# Altium project Simrig_controller.PrjPcb
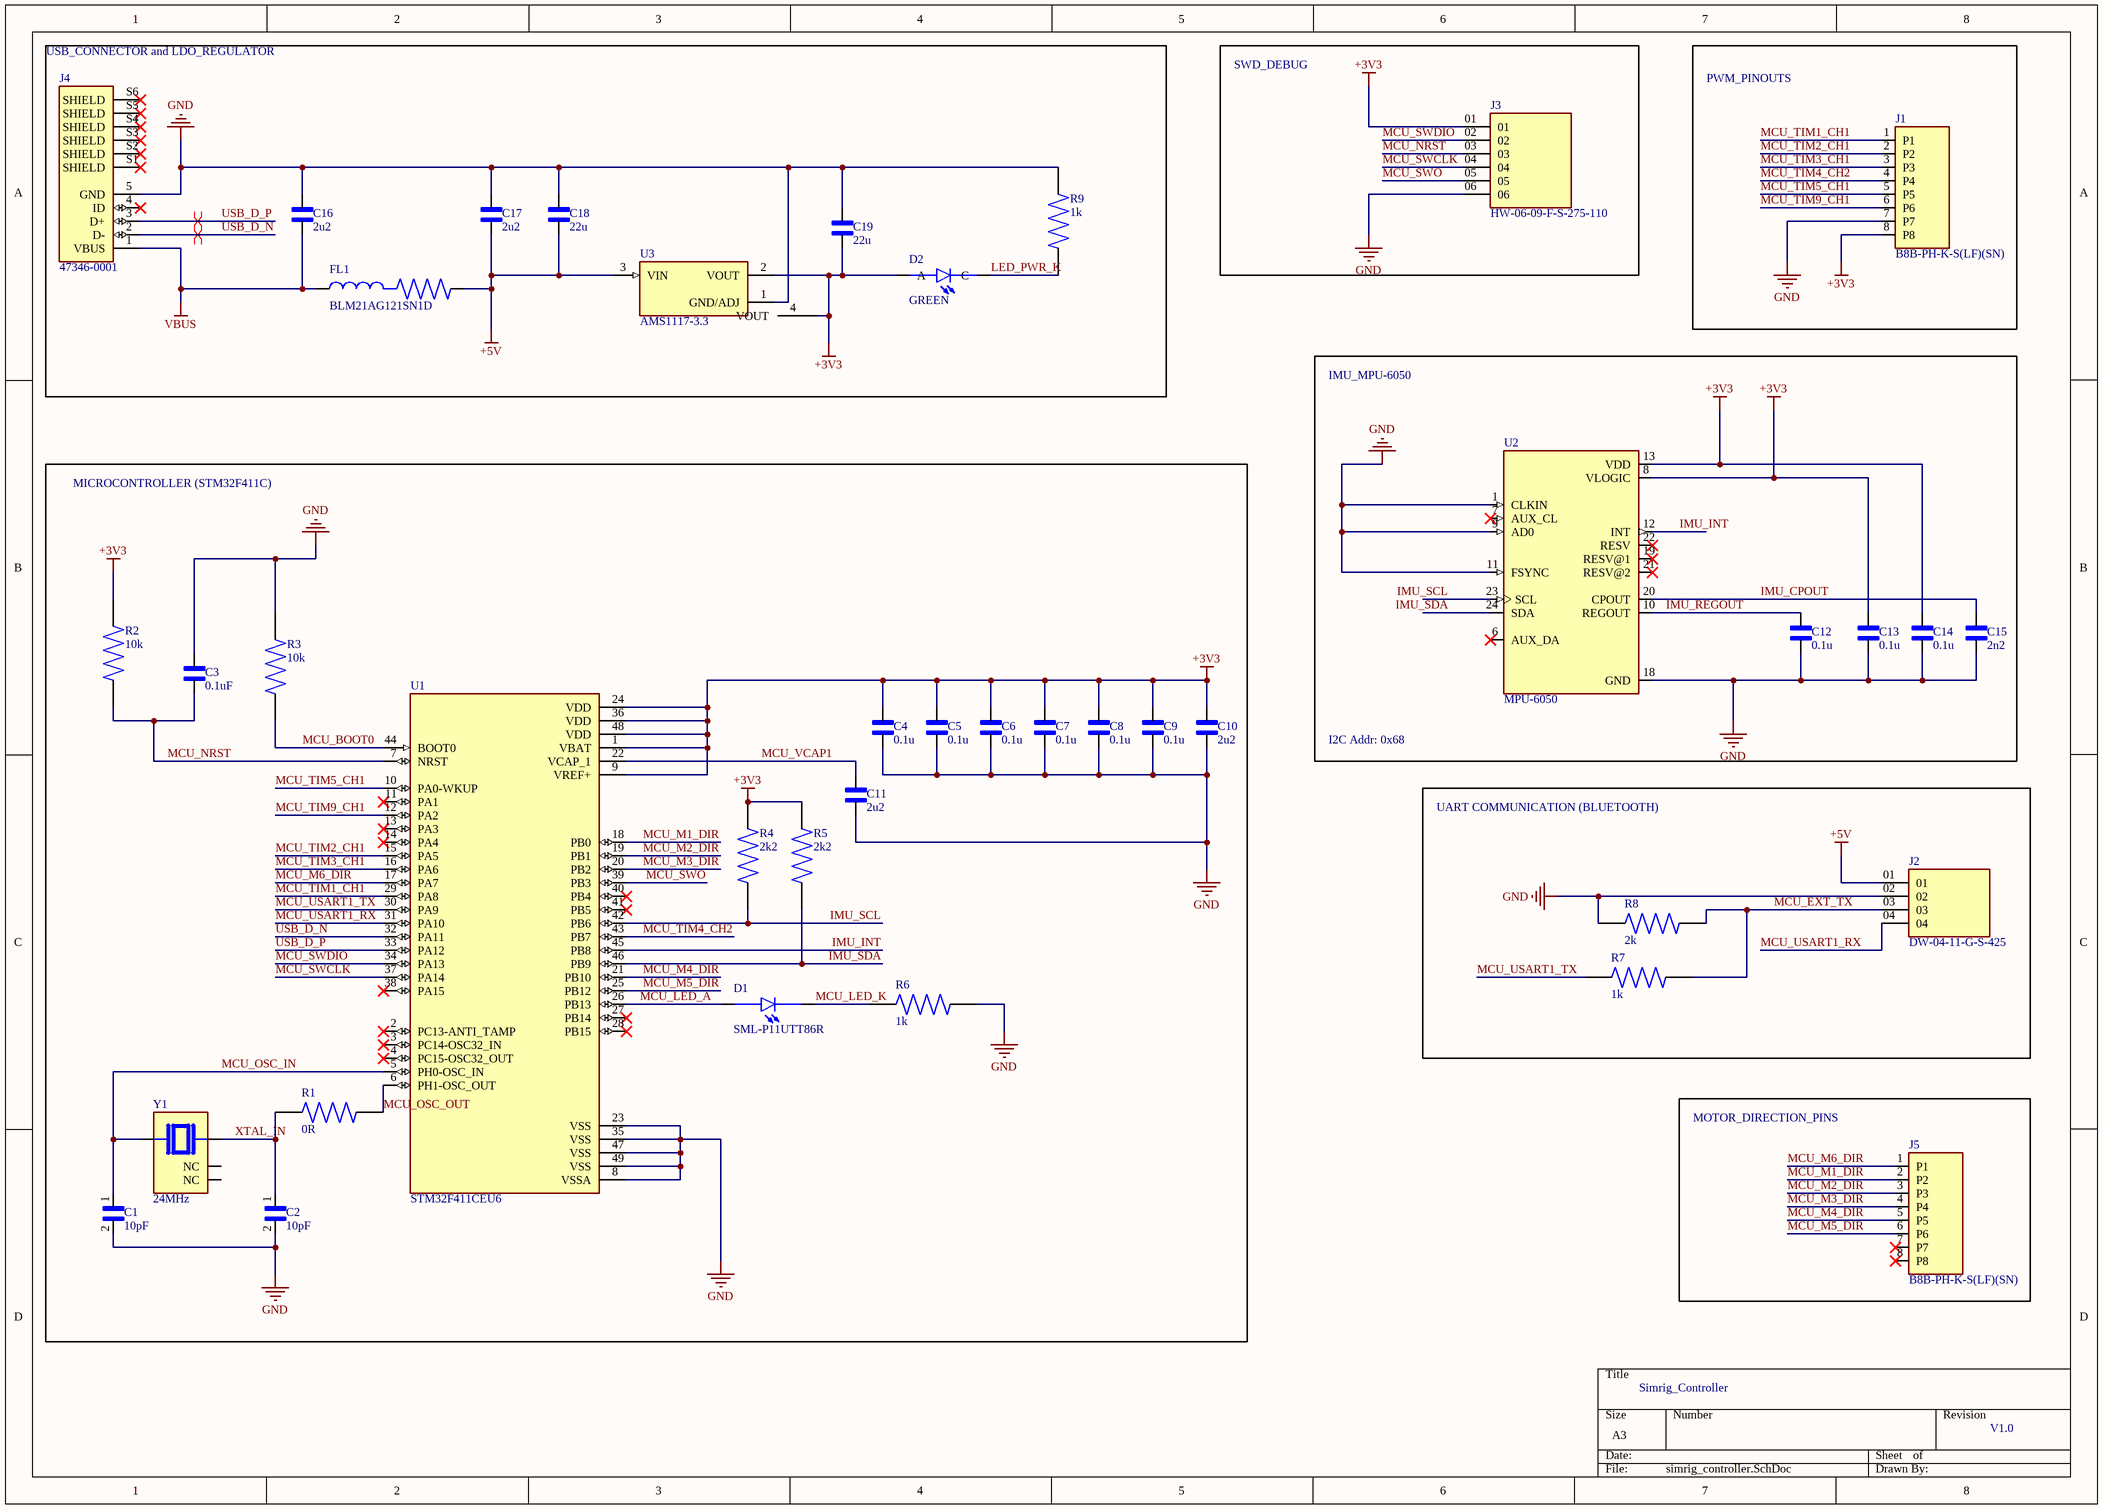
[diagram p0: simrig_controller.SchDoc]
1 sheet, 40 parts. Net scope: global (net labels, ports and power ports of the same name join across sheets).
Board file: simrig_controller.PcbDoc

## Sheet simrig_controller.SchDoc
size A3

### Parts
C1  10pF  [CAPC1005X55N]
C2  10pF  [CAPC1005X55N]
C3  0.1uF  [CAPC1005X55N]
C4  0.1u  [CAPC1005X55N]
C5  0.1u  [CAPC1005X55N]
C6  0.1u  [CAPC1005X55N]
C7  0.1u  [CAPC1005X55N]
C8  0.1u  [CAPC1005X55N]
C9  0.1u  [CAPC1005X55N]
C10  2u2  [CAPC1608X90N]
C11  2u2  [CAPC1608X90N]
C12  0.1u  [CAPC1005X55N]
C13  0.1u  [CAPC1005X55N]
C14  0.1u  [CAPC1005X55N]
C15  2n2  [CAPC1005X55N]
C16  2u2  [CAPC1608X90N]
C17  2u2  [CAPC1608X90N]
C18  22u  [CAPC2012X145N]
C19  22u  [CAPC2012X145N]
D1  SML-P11UTT86R  [LED_SML-P11UTT86R]
D2  GREEN  [LED_SML-P11UTT86R]
FL1  BLM21AG121SN1D  [BEADC2012X105N]
J1  B8B-PH-K-S(LF)(SN)  [JST_B8B-PH-K-S(LF)(SN)]
J2  DW-04-11-G-S-425  [SAMTEC_DW-04-11-G-S-425]
J3  HW-06-09-F-S-275-110  [SAMTEC_HW-06-09-F-S-275-110]
J4  47346-0001  [MOLEX_47346-0001]
J5  B8B-PH-K-S(LF)(SN)  [JST_B8B-PH-K-S(LF)(SN)]
R1  0R  [RESC1005X37N]
R2  10k  [RESC1005X37N]
R3  10k  [RESC1005X37N]
R4  2k2  [RESC1005X35N]
R5  2k2  [RESC1005X35N]
R6  1k  [RESC1005X37N]
R7  1k  [RESC1005X37N]
R8  2k  [RESC1005X37N]
R9  1k  [RESC1005X37N]
U1  STM32F411CEU6  [QFN50P700X700X60-49N]
U2  MPU-6050  [QFN50P400X400X95-24N]
U3  AMS1117-3.3  [SOT229P700X180-4N]
Y1  24MHz  [XTAL_7V24000002]

### Blocks framed on the sheet
USB_CONNECTOR and LDO_REGULATOR: C16-C19 D2 FL1 J4 R9 U3
SWD_DEBUG: J3
PWM_PINOUTS: J1
MICROCONTROLLER (STM32F411C): C1-C11 D1 R1-R6 U1 Y1
UART COMMUNICATION (BLUETOOTH): J2 R7 R8
MOTOR_DIRECTION_PINS: J5

### Nets
+3V3: C4.1 C5.1 C6.1 C7.1 C8.1 C9.1 C10.2 C13.1 C14.1 C19.1 D2.A J1.8(P8) J3.01 R2.1 R4.2 R5.2 U1.1(VBAT) U1.9(VREF+) U1.24(VDD) U1.36(VDD) U1.48(VDD) U2.8(VLOGIC) U2.13(VDD) U3.2(VOUT) U3.4(VOUT)
+5V: C17.1 C18.1 FL1.2 J2.01 U3.3(VIN)
GND: C1.2 C2.2 C3.1 C4.2 C5.2 C6.2 C7.2 C8.2 C9.2 C10.1 C11.1 C12.1 C13.2 C14.2 C15.2 C16.2 C17.2 C18.2 C19.2 J1.7(P7) J2.02 J3.06 J4.5(GND) R3.2 R6.1 R8.2 R9.2 U1.8(VSSA) U1.23(VSS) U1.35(VSS) U1.47(VSS) U1.49(VSS) U2.1(CLKIN) U2.9(AD0) U2.11(FSYNC) U2.18(GND) U3.1(GND/ADJ)
VBUS: C16.1 FL1.1 J4.1(VBUS)
IMU_CPOUT: C15.1 U2.20(CPOUT)
IMU_INT: U1.45(PB8) U2.12(INT)
IMU_REGOUT: C12.2 U2.10(REGOUT)
IMU_SCL: R4.1 U1.42(PB6) U2.23(SCL)
IMU_SDA: R5.1 U1.46(PB9) U2.24(SDA)
LED_PWR_K: D2.C R9.1
MCU_BOOT0: R3.1 U1.44(BOOT0)
MCU_EXT_TX: J2.03 R7.1 R8.1
MCU_LED_A: D1.A U1.26(PB13)
MCU_LED_K: D1.C R6.2
MCU_M1_DIR: J5.2(P2) U1.18(PB0)
MCU_M2_DIR: J5.3(P3) U1.19(PB1)
MCU_M3_DIR: J5.4(P4) U1.20(PB2)
MCU_M4_DIR: J5.5(P5) U1.21(PB10)
MCU_M5_DIR: J5.6(P6) U1.25(PB12)
MCU_M6_DIR: J5.1(P1) U1.17(PA7)
MCU_NRST: C3.2 J3.03 R2.2 U1.7(NRST)
MCU_OSC_IN: C1.1 U1.5(PH0-OSC_IN) Y1.1
MCU_OSC_OUT: R1.1 U1.6(PH1-OSC_OUT)
MCU_SWCLK: J3.04 U1.37(PA14)
MCU_SWDIO: J3.02 U1.34(PA13)
MCU_SWO: J3.05 U1.39(PB3)
MCU_TIM1_CH1: J1.1(P1) U1.29(PA8)
MCU_TIM2_CH1: J1.2(P2) U1.15(PA5)
MCU_TIM3_CH1: J1.3(P3) U1.16(PA6)
MCU_TIM4_CH2: J1.4(P4) U1.43(PB7)
MCU_TIM5_CH1: J1.5(P5) U1.10(PA0-WKUP)
MCU_TIM9_CH1: J1.6(P6) U1.12(PA2)
MCU_USART1_RX: J2.04 U1.31(PA10)
MCU_USART1_TX: R7.2 U1.30(PA9)
MCU_VCAP1: C11.2 U1.22(VCAP_1)
USB_D_N: J4.2(D-) U1.32(PA11)
USB_D_P: J4.3(D+) U1.33(PA12)
XTAL_IN: C2.1 R1.2 Y1.3

Not connected (* = marked no-connect by the designer): J4 4(ID)* S1(SHIELD)* S2(SHIELD)* S3(SHIELD)* S4(SHIELD)* S5(SHIELD)* S6(SHIELD)*; J5 7(P7)* 8(P8)*; U1 2(PC13-ANTI_TAMP)* 3(PC14-OSC32_IN)* 4(PC15-OSC32_OUT)* 11(PA1)* 13(PA3)* 14(PA4)* 27(PB14)* 28(PB15)* 38(PA15)* 40(PB4)* 41(PB5)*; U2 6(AUX_DA)* 7(AUX_CL)* 19(RESV@1)* 21(RESV@2)* 22(RESV)*; Y1 2(NC) 4(NC)

### Layout directives
differential pair; net class DIFF_USB: USB_D_N, USB_D_P

### Notes on the sheet
- IMU_MPU-6050
- I2C Addr: 0x68
- Simrig_Controller
- V1.0

### Library data of the parts
C1 C2 = CC0402JRNPO9BN100: CERAMIC CAPACITOR 10PF 50V, C0G, 5%, 0402, FULL REEL; MF: {'manufacturer': u'Yageo'}; Package: None; Price: None; Value: *; MP: CC0402JRNPO9BN100; Availability: Unavailable
C3-C9 C12-C15 = C0402C104K4RALTU: CAP CER 0.1UF 16V 10% X7R 0402; MF: {'manufacturer': u'KEMET'}; Package: None; Price: None; Value: *; MP: C0402C104K4RALTU; Availability: Unavailable
C10 C11 C16 C17 = GRM188R61E225MA12D: MF: {'manufacturer': u'Murata'}; Package: None; Price: None; Value: *; MP: GRM188R61E225MA12D; Availability: Unavailable
C18 C19 = C2012X6S1C226M125AC: 22ÂµF Â±20% 16V Ceramic Capacitor X6S 0805 (2012 Metric); MF: {'manufacturer': u'TDK'}; Package: None; Price: None; Value: *; MP: C2012X6S1C226M125AC; Availability: Unavailable
D1 = SML-P11UTT86R: LED, PICOLED, Red, 621 nm, 1.8 V, 1 mA, 2.5 mcd; MF: {'manufacturer': u'Rohm'}; Package: None; Price: None; Value: *; MP: SML-P11UTT86R; Availability: Unavailable
D2 = SML-P12PTT86: LED Uni-Color Green 2-Pin SMD T/R; MF: {'manufacturer': u'Rohm'}; Package: None; Price: None; Value: *; MP: SML-P12PTT86; Availability: Unavailable
FL1 = BLM21AG121SN1D: FERRITE BEAD, 0805 CASE, 120OHM; Inductor Type:Ferrite Bead; Series:BLM21; Resistance:0.15ohm; DC Current Max:200mA; Case Style:0805; Core Material:Ferrite; Temp, Op. Max:+125Â°C; Temp, Op. Min:-55Â°C; Typ Impedance @ 100MHz:120ohm; MF: {'manufacturer': u'Murata'}; Package: None; Price: None; Value: *; MP: BLM21AG121SN1D; Availability: Unavailable
J1 J5 = B8B-PH-K-S(LF)(SN): PH Series 2 mm Pitch 8 Position Through Hole Top Entry Shrouded Header; MF: {'manufacturer': u'JST Sales'}; Package: None; Price: None; Value: *; MP: B8B-PH-K-S(LF)(SN); Availability: Unavailable
J2 = DW-04-11-G-S-425: MF: {'manufacturer': u'Samtec'}; Package: None; Price: None; Value: *; MP: DW-04-11-G-S-425; Availability: Unavailable
J3 = HW-06-09-F-S-275-110: MF: {'manufacturer': u'Samtec'}; Package: None; Price: None; Value: *; MP: HW-06-09-F-S-275-110; Availability: Unavailable
J4 = 47346-0001: USB Connectors MICRO USB B RECPT BTTM MOUNT ASSY; MF: {'manufacturer': u'Molex'}; Package: None; Price: None; Value: *; MP: 47346-0001; Availability: Unavailable
R1-R3 R6-R9 = MCS04020D1002BE000: MF: {'manufacturer': u'Vishay'}; Package: None; Price: None; Value: *; MP: MCS04020D1002BE000; Availability: Unavailable
R4 R5 = RT0402BRB072K2L: RES SMD 2.2K OHM 0.1% 1/16W 0402; MF: {'manufacturer': u'Yageo'}; Package: None; Price: None; Value: *; MP: RT0402BRB072K2L; Availability: Unavailable
U1 = STM32F411CEU6: High-performance access line, ARM Cortex-M4 core with DSP and FPU, 512 Kbytes Flash, 100 MHz CPU, ART Accelerator; MF: {'manufacturer': u'STMicroelectronics'}; Package: None; Price: None; Value: *; MP: STM32F411CEU6; Availability: Unavailable
U2 = MPU-6050: MPU-6050 Six-Axis (Gyro + Accelerometer) MEMS MotionTrackingâ„¢ Devices; MF: {'manufacturer': u'TDK InvenSense'}; Package: None; Price: None; Value: *; MP: MPU-6050; Availability: Unavailable
U3 = AMS1117-3.3: MF: {'manufacturer': u'ams AG'}; Package: None; Price: None; Value: *; MP: AMS1117-3.3; Availability: Unavailable
Y1 = 7V24000002: MF: {'manufacturer': u'TXC CORPORATION'}; Package: None; Price: None; Value: *; MP: 7V24000002; Availability: Unavailable